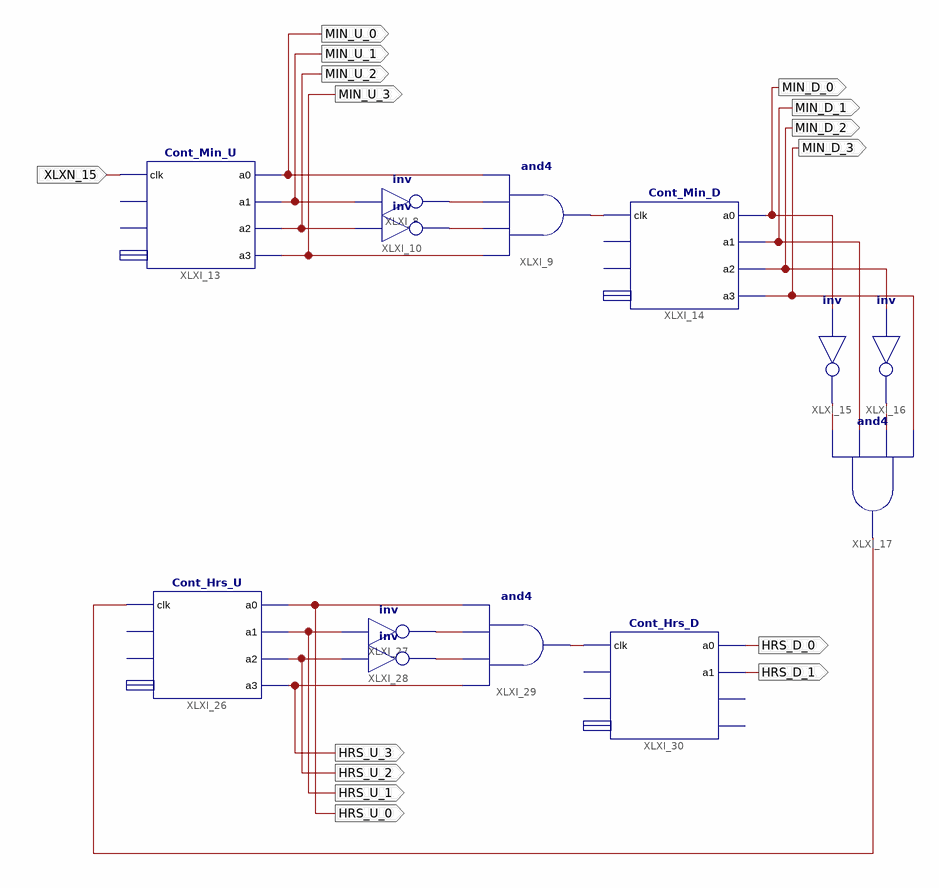
[diagram p0: schematic sheet 1]
// Xilinx ISE schematic esquema_reloj.sch (spartan3) as structural Verilog: 13 symbols, 15 ports
module esquema_reloj (
  input  XLXN_15,
  output MIN_U_0,
  output MIN_U_1,
  output MIN_U_2,
  output MIN_U_3,
  output MIN_D_2,
  output MIN_D_3,
  output MIN_D_1,
  output MIN_D_0,
  output HRS_U_0,
  output HRS_U_1,
  output HRS_U_2,
  output HRS_U_3,
  output HRS_D_0,
  output HRS_D_1
);

  wire XLXN_44, XLXN_57, XLXN_66, XLXN_72, XLXN_74, XLXN_117, XLXN_118, XLXN_119, XLXN_122;

  not XLXI_8 (XLXN_44, MIN_U_1);
  and XLXI_9 (XLXN_66, MIN_U_3, XLXN_57, XLXN_44, MIN_U_0);
  not XLXI_10 (XLXN_57, MIN_U_2);
  Cont_Min_U XLXI_13 (
    .clk(XLXN_15), .a0(MIN_U_0), .a1(MIN_U_1), .a2(MIN_U_2), .a3(MIN_U_3));  // open: areset, aload, data
  Cont_Min_D XLXI_14 (
    .clk(XLXN_66), .a0(MIN_D_0), .a1(MIN_D_1), .a2(MIN_D_2), .a3(MIN_D_3));  // open: areset, aload, data
  not XLXI_15 (XLXN_72, MIN_D_0);
  not XLXI_16 (XLXN_74, MIN_D_2);
  and XLXI_17 (XLXN_122, XLXN_72, MIN_D_1, XLXN_74, MIN_D_3);
  Cont_Hrs_U XLXI_26 (
    .clk(XLXN_122), .a0(HRS_U_0), .a1(HRS_U_1), .a2(HRS_U_2), .a3(HRS_U_3));  // open: areset, aload, data
  not XLXI_27 (XLXN_118, HRS_U_1);
  not XLXI_28 (XLXN_117, HRS_U_2);
  and XLXI_29 (XLXN_119, HRS_U_3, XLXN_117, XLXN_118, HRS_U_0);
  Cont_Hrs_D XLXI_30 (.clk(XLXN_119), .a0(HRS_D_0), .a1(HRS_D_1));  // open: areset, aload, data, a2, a3
endmodule
